# Altium project SMDiDCR.PrjPcb
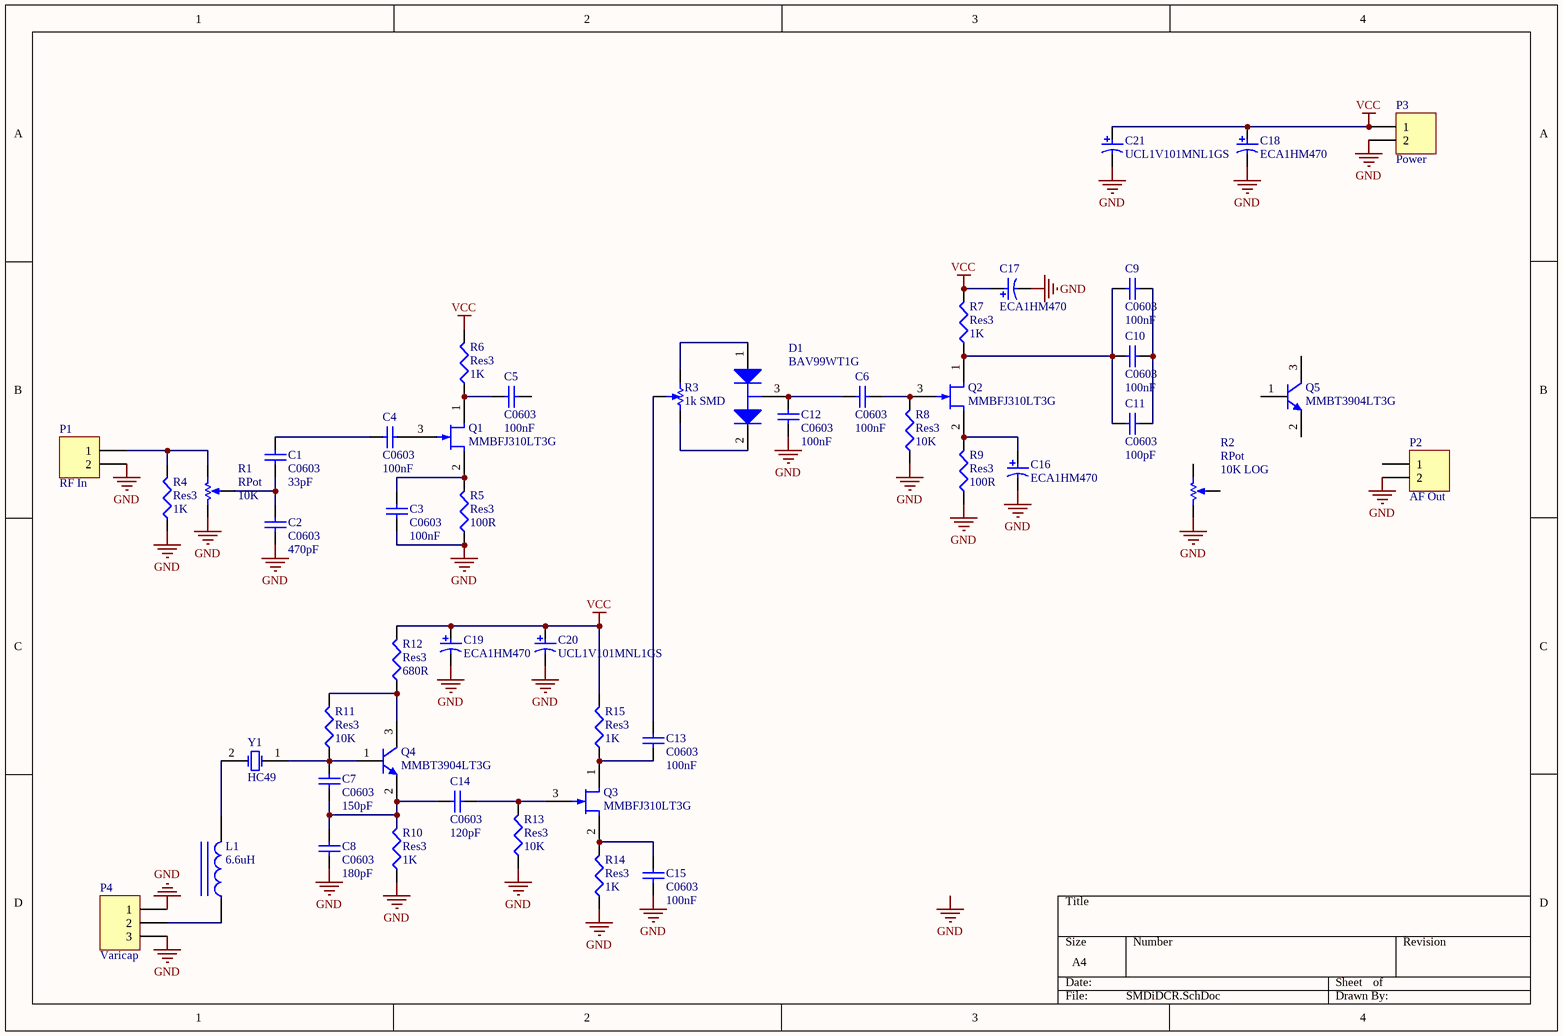
[diagram p0: SMDiDCR.SchDoc]
1 sheet, 48 parts. Net scope: global (net labels, ports and power ports of the same name join across sheets).
Board file: SMDiDCR.PcbDoc

## Sheet SMDiDCR.SchDoc: SMDiDCR
size A4; Author: ftg; CompanyName: Bonk.Solutions; DrawnBy: ftg; Engineer: ftg; SheetNumber: 1; SheetTotal: 1; DocumentName: SMDiDCR; ProjectName: SMDiDCR

### Parts
C1  C0603  value 33pF  [0603]
C2  C0603  value 470pF  [0603]
C3  C0603  value 100nF  [0603]
C4  C0603  value 100nF  [0603]
C5  C0603  value 100nF  [0603]
C6  C0603  value 100nF  [0603]
C7  C0603  value 150pF  [0603]
C8  C0603  value 180pF  [0603]
C9  C0603  value 100nF  [0603]
C10  C0603  value 100nF  [0603]
C11  C0603  value 100pF  [0603]
C12  C0603  value 100nF  [0603]
C13  C0603  value 100nF  [0603]
C14  C0603  value 120pF  [0603]
C15  C0603  value 100nF  [0603]
C16  ECA1HM470  [CAPPR55-250-1120X630X1220]
C17  ECA1HM470  [CAPPR55-250-1120X630X1220]
C18  ECA1HM470  [CAPPR55-250-1120X630X1220]
C19  ECA1HM470  [CAPPR55-250-1120X630X1220]
C20  UCL1V101MNL1GS  [NIC-UCL1V101MNL1GS_L]
C21  UCL1V101MNL1GS  [NIC-UCL1V101MNL1GS_L]
D1  BAV99WT1G  [ONSC-SOT-323-3-419-04_V]
L1  value 6.6uH  [AXIAL-0.9]  (hidden comment: Inductor Iron)
P1  RF In  [HDR1X2]
P2  AF Out  [HDR1X2]
P3  Power  [HDR1X2]
P4  Varicap  [HDR1X3]
Q1  MMBFJ310LT3G  [ONSC-SOT-23-3-318-08_V]
Q2  MMBFJ310LT3G  [ONSC-SOT-23-3-318-08_V]
Q3  MMBFJ310LT3G  [ONSC-SOT-23-3-318-08_V]
Q4  MMBT3904LT3G  [ONSC-SOT-23-3-318-08_V]
Q5  MMBT3904LT3G  [ONSC-SOT-23-3-318-08_V]
R1  RPot  value 10K  [VR5]
R2  RPot  value 10K LOG  [VR5]
R3  1k SMD  [POT4MM-2]
R4  Res3  value 1K  [J1-0603]
R5  Res3  value 100R  [J1-0603]
R6  Res3  value 1K  [J1-0603]
R7  Res3  value 1K  [J1-0603]
R8  Res3  value 10K  [J1-0603]
R9  Res3  value 100R  [J1-0603]
R10  Res3  value 1K  [J1-0603]
R11  Res3  value 10K  [J1-0603]
R12  Res3  value 680R  [J1-0603]
R13  Res3  value 10K  [J1-0603]
R14  Res3  value 1K  [J1-0603]
R15  Res3  value 1K  [J1-0603]
Y1  HC49  [HC-49U]

### Nets
GND: C2.1 C3.1 C8.1 C12.1 C15.2 C16.2 C17.2 C18.2 C19.2 C20.2 C21.2 P1.2 P2.2 P3.2 P4.1 P4.3 R1.2(BOT) R2.2(BOT) R4.1 R5.1 R8.1 R9.1 R10.1 R13.1 R14.1
VCC: C17.1 C18.1 C19.1 C20.1 C21.1 P3.1 R6.2 R7.2 R12.2 R15.2
NetC1_1: C1.1 C2.2 R1.3(TAP)
NetC1_2: C1.2 C4.2
NetC3_2: C3.2 Q1.2(S) R5.2
NetC4_1: C4.1 Q1.3(G)
NetC5_2: C5.2 Q1.1(D) R6.1
NetC6_1: C6.1 C12.2 D1.3(K/A)
NetC6_2: C6.2 Q2.3(G) R8.2
NetC7_1: C7.1 C8.2 C14.2 Q4.2(E) R10.2
NetC7_2: C7.2 Q4.1(B) R11.1 Y1.1(OSC1)
NetC9_1: C9.1 C10.1 C11.1 Q2.1(D) R7.1
NetC9_2: C9.2 C10.2 C11.2
NetC13_1: C13.1 Q3.1(D) R15.1
NetC13_2: C13.2 R3.W
NetC14_1: C14.1 Q3.3(G) R13.2
NetC15_1: C15.1 Q3.2(S) R14.2
NetC16_1: C16.1 Q2.2(S) R9.2
NetD1_1: D1.1(A) R3.CCW(-)
NetD1_2: D1.2(K) R3.CW(+)
NetL1_1: L1.1 P4.2
NetL1_2: L1.2 Y1.2(OSC2)
NetP1_1: P1.1 R1.1(TOP) R4.2
NetQ4_3: Q4.3(C) R11.2 R12.1

Not connected (* = marked no-connect by the designer): C5 1; P2 1; Q5 1(B) 2(E) 3(C); R2 1(TOP) 3(TAP)

### Notes on the sheet
- Labels drawn without touching a wire or pin: GND

### Library data of the parts
C1-C15 = C0603: Ceramic Chip Capacitor - Standard; Note: Footprint corresponds to dimensions for bulk cassette packaging. This case size has tightened tolerances.; Published: 17-Jul-2002; LatestRevisionDate: 19-Mar-2004; LatestRevisionNote: Silkscreen size reduced.; DatasheetDocument: Mar-2001; PackageDocument: Mar-2001; PackageReference: 0603; Publisher: Altium Limited; Code_JEITA: 0603; Code_IPC: 1608 [0603]; ComponentLink1Description: Manufacturer Link; ComponentLink1URL: http://www.kemet.com/; ComponentLink2Description: Datasheet; ComponentLink2URL: http://www.kemet.com/kemet/web/homepage/kechome.nsf/vapubfilesname/F3102TA.pdf/$file/F3102TA.pdf
C16-C19 = CMP-2100-03626-1: Aluminum Electrolytic Capacitor, 47 uF, +/- 20%, 50 V, -40 to 85 degC, 2-Pin THD, RoHS, Bulk; Manufacturer: Panasonic; Voltage Rating: 50V; Ripple Current: 130mA; Dissipation Factor: 0.12%; Capacitance: 47uF; Lead Diameter: 0.5mm; Lead/Base Style: Straight; Life (Hours): 2000Hour; Leakage Current: 3uA; Diameter: 6.3mm; REACH SVHC: NoSVHC; Mount: ThroughHole; Package Reference: CAPPR55-250-1120X630X1220; Package Quantity: 200; Case/Package: Radial; Voltage Rating (DC): 50V; Packaging: Bulk; Length: 11.2mm; Manufacturer URL: http://www.panasonic.com/; Datasheet URL: https://industrial.panasonic.com/cdbs/www-data/pdf/RDF0000/ABA0000C1218.pdf; Height: 11.2mm; Package Description: 2-Pin Radial Lead, Dia 6.3 mm, Height 12.2 mm; Min Operating Temperature: -40degC; Tolerance: 20%; Datasheet Version: Rev. 05, 10/2016; RoHSCompliant: true; Termination: Radial; Voltage: 50V; Radiation Hardening: No; Height - Seated (Max): 0.48inch; Max Operating Temperature: 85degC; Lead Pitch: 2.5mm
C20 C21 = CMP-2000-07344-1: Aluminum Electrolytic Capacitor, 100 uF, 35 V, 20%, -55 to 105 degC, 2-Pin SMD, RoHS, Tape and Reel; Manufacturer: Nichicon; Capacitance: 100uF; Dissipation Factor DF: 0.12; Case Diameter: 8mm; Ripple Current: 850mA; Type: AluminumElectrolyticCapacitors,ChipType,LowImpedance; Case Height: 8.3mm; Leakage Current: 3uA; Voltage Rating DC: 35V; Load Life: 2000h; Case Length: 10mm; Series: CL; Minimum Operating Temperature: -55C; Datasheet URL: http://datasheet.octopart.com/UCL1V101MNL1GS-Nichicon-datasheet-41194108.pdf; Manufacturer URL: http://www.nichicon.co.jp/english/; Maximum Operating Temperature: +105C; Package Reference: UCL1V101MNL1GS; Operating Temperature Range: -55Cto+105C; Brand: Nichicon; Package Description: 2-Pin Surface Mount Device, Body 8.3 x 8.3 mm, Height 10.8 mm; RoHS: Details; Voltage Rating: 35V; Dimensions: 8mmDia.x10mmLx8.3mmH; Termination Style: SMD/SMT; Datasheet Version: 01/2015; Packaging: Reel; Mounting Technology: SurfaceMount; Product Category: AluminumElectrolyticCapacitors-SMD; Factory Pack Quantity: 500; Product: LowImpedanceElectrolyticCapacitors; Tolerance: 20%
D1 = CMP-1054-00187-1: Dual Series Switching Diodes, 3-Pin SOT-323, Pb-Free, Tape and Reel; Manufacturer: On Semiconductor; trr Max (ns): 6; IF Max (A): 0.215; Configuration: Dual Series; ComponentLink1Description: Manufacturer URL; ComponentLink1URL: http://www.onsemi.com/; ComponentLink2Description: Datasheet; PackageDescription: 3-Pin Small Outline Transistor, Body 2 x 1.25 mm, Pitch 0.65 mm; PackageReference: SOT-323-3-419-04; ComponentLink3URL: http://www.onsemi.com/pub_link/Collateral/419-04.PDF; Packing: Tape and Reel; ComponentLink3Description: Package Specification; DatasheetVersion: Rev. 7; RoHS: TRUE; ComponentLink2URL: http://www.onsemi.cn/pub_link/Collateral/BAV99WT1-D.PDF; Mounting Technology: Surface Mount; PartNumber: BAV99WT1G; PackageVersion: Rev. N, 11/2008
L1 = Inductor Iron: Magnetic-Core Inductor; Published: 24-Mar-1999; LatestRevisionDate: 17-Jul-2002; LatestRevisionNote: Re-released for DXP Platform.; PackageReference: AXIAL-0.9; Publisher: Altium Limited; PackageDescription: Axial Device, Thru-Hole; 2 Leads; 0.9 in Pin Spacing
P1-P3 = Header 2: Header, 2-Pin; LatestRevisionDate: 17-Jul-2002; LatestRevisionNote: Re-released for DXP Platform.; Publisher: Altium Limited
P4 = Header 3: Header, 3-Pin; LatestRevisionDate: 17-Jul-2002; LatestRevisionNote: Re-released for DXP Platform.; Publisher: Altium Limited
Q1-Q3 = CMP-1062-00032-1: JFET - VHF / UHF Amplifier Transistor, N-Channel, 3-Pin SOT-23, Pb-Free, Tape and Reel; Manufacturer: On Semiconductor; V(BR)GSS Min (V): 25; Ciss Max (pF): 5; IDSS Min (uA): 24000; Channel Polarity: N Channel; Crss Max (pF): 2.5; IDSS Max (uA): 60000; ComponentLink3URL: http://www.onsemi.cn/pub_link/Collateral/318-08.PDF; ComponentLink1URL: http://www.onsemi.com/; Mounting Technology: Surface Mount; PartNumber: MMBFJ310LT3G; RoHS: Pb-Free; ComponentLink2Description: Datasheet; ComponentLink3Description: Package Specification; PackageReference: SOT-23-3-318-08; PackageDescription: 3-Pin Small Outline Transistor, Body 2.92 x 1.3 mm, Pitch 0.95 mm; PackageVersion: Rev. AP, 11/2009; DatasheetVersion: Rev. 7; ComponentLink2URL: http://www.onsemi.cn/pub_link/Collateral/MMBFJ309LT1-D.PDF; Packing: Tape and Reel; ComponentLink1Description: Manufacturer URL
Q4 Q5 = CMP-1048-00630-1: General Purpose Transistor, NPN Silicon, 3-Pin SOT-23, Pb-Free, Tape and Reel; Manufacturer: On Semiconductor; fT Min (MHz): 300; IC Continuous (A): 0.2; PackageVersion: Rev. AP, 11/2009; PackageReference: SOT-23-3-318-08; Packing: Tape and Reel; RoHS: TRUE; ComponentLink2Description: Datasheet; PackageDescription: 3-Pin Small Outline Transistor, Body 2.92 x 1.3 mm, Pitch 0.95 mm; PartNumber: MMBT3904LT3G; ComponentLink1Description: Manufacturer URL; ComponentLink3URL: http://www.onsemi.cn/pub_link/Collateral/318-08.PDF; Mounting Technology: Surface Mount; ComponentLink3Description: Package Specification; DatasheetVersion: Rev. 12; ComponentLink1URL: http://www.onsemi.com/; ComponentLink2URL: http://www.onsemi.cn/pub_link/Collateral/MMBT3904LT1-D.PDF; Polarity: NPN
R1 R2 = RPot: Potentiometer; Sim Note: Enter the Resistance value and the set point into parameter fields.; Set Position: 0.5; Published: 8-Jun-2000; LatestRevisionDate: 17-Jul-2002; LatestRevisionNote: Re-released for DXP Platform.; PackageReference: VR5; Publisher: Altium Limited; PackageDescription: Variable Resistor, Thru-Hole; 3 Leads
R3 = RPot SM: Square Trimming Potentiometer; Published: 17-Dec-2003; DatasheetVersion: Oct-2003; PackageReference: POT4MM-2; Publisher: Altium Limited; PackageDescription: Square Trimming Potentiometer; ComponentLink1Description: Manufacturer Link; ComponentLink1URL: http://bourns.com/2/search.html; Value: 1k
R4-R15 = Res3: Resistor; Published: 8-Jun-2000; LatestRevisionDate: 29-May-2009; LatestRevisionNote: IPC-7351 Footprint Added.; PackageReference: J1-0603; Publisher: Altium Limited; PackageDescription: Chip Resistor
Y1 = ECS-10-13-1: Crystal Oscillator; Published: 17-Jul-2002; DatasheetDocument: 18-Apr-2000; PackageReference: HC-49U; Publisher: Altium Limited; ComponentLink1Description: Manufacturer Link; ComponentLink1URL: http://www.ecsxtal.com/; ComponentLink2Description: Datasheet; ComponentLink2URL: http://www.ecsxtal.com/pdf2/HC49U.PDF